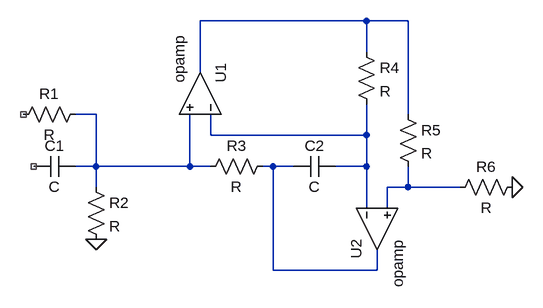
[diagram p0: schematic Draft1.asc]
Draft1.asc, the LTspice schematic file:
Version 4
SHEET 1 880 680
WIRE 544 -64 288 -64
WIRE 608 -64 544 -64
WIRE 544 -16 544 -64
WIRE 288 16 288 -64
WIRE 128 80 96 80
WIRE 608 80 608 -64
WIRE 304 112 304 80
WIRE 544 112 544 64
WIRE 544 112 304 112
WIRE 128 160 128 80
WIRE 128 160 96 160
WIRE 272 160 272 80
WIRE 272 160 128 160
WIRE 304 160 272 160
WIRE 400 160 384 160
WIRE 432 160 400 160
WIRE 544 160 544 112
WIRE 544 160 496 160
WIRE 128 192 128 160
WIRE 608 192 608 160
WIRE 608 192 576 192
WIRE 688 192 608 192
WIRE 544 224 544 160
WIRE 576 224 576 192
WIRE 400 320 400 160
WIRE 560 320 560 288
WIRE 560 320 400 320
FLAG 128 272 0
FLAG 768 192 0
SYMBOL res 112 64 R90
WINDOW 0 0 56 VBottom 2
WINDOW 3 32 56 VTop 2
SYMATTR InstName R1
SYMBOL cap 96 144 R90
WINDOW 0 0 32 VBottom 2
WINDOW 3 32 32 VTop 2
SYMATTR InstName C1
SYMBOL res 112 176 R0
SYMATTR InstName R2
SYMBOL Opamps\\opamp 352 48 M270
SYMATTR InstName U1
SYMBOL res 400 144 R90
WINDOW 0 0 56 VBottom 2
WINDOW 3 32 56 VTop 2
SYMATTR InstName R3
SYMBOL cap 496 144 R90
WINDOW 0 0 32 VBottom 2
WINDOW 3 32 32 VTop 2
SYMATTR InstName C2
SYMBOL Opamps\\opamp 496 256 M90
SYMATTR InstName U2
SYMBOL res 528 -32 R0
SYMATTR InstName R4
SYMBOL res 592 64 R0
SYMATTR InstName R5
SYMBOL res 784 176 R90
WINDOW 0 0 56 VBottom 2
WINDOW 3 32 56 VTop 2
SYMATTR InstName R6

The netlist it stands for:
* Draft1.asc
R1 N002 NC_01 R
C1 N002 NC_02 C
R2 N002 0 R
XU1 N003 N002 N001 opamp Aol=100K GBW=10Meg  ; pins invin noninvin out
R3 N004 N002 R
C2 N003 N004 C
XU2 N003 N005 N004 opamp Aol=100K GBW=10Meg  ; pins invin noninvin out
R4 N001 N003 R
R5 N001 N005 R
R6 0 N005 R
.backanno
.end